# EAGLE design stb_v10 (EAGLE 6.1)
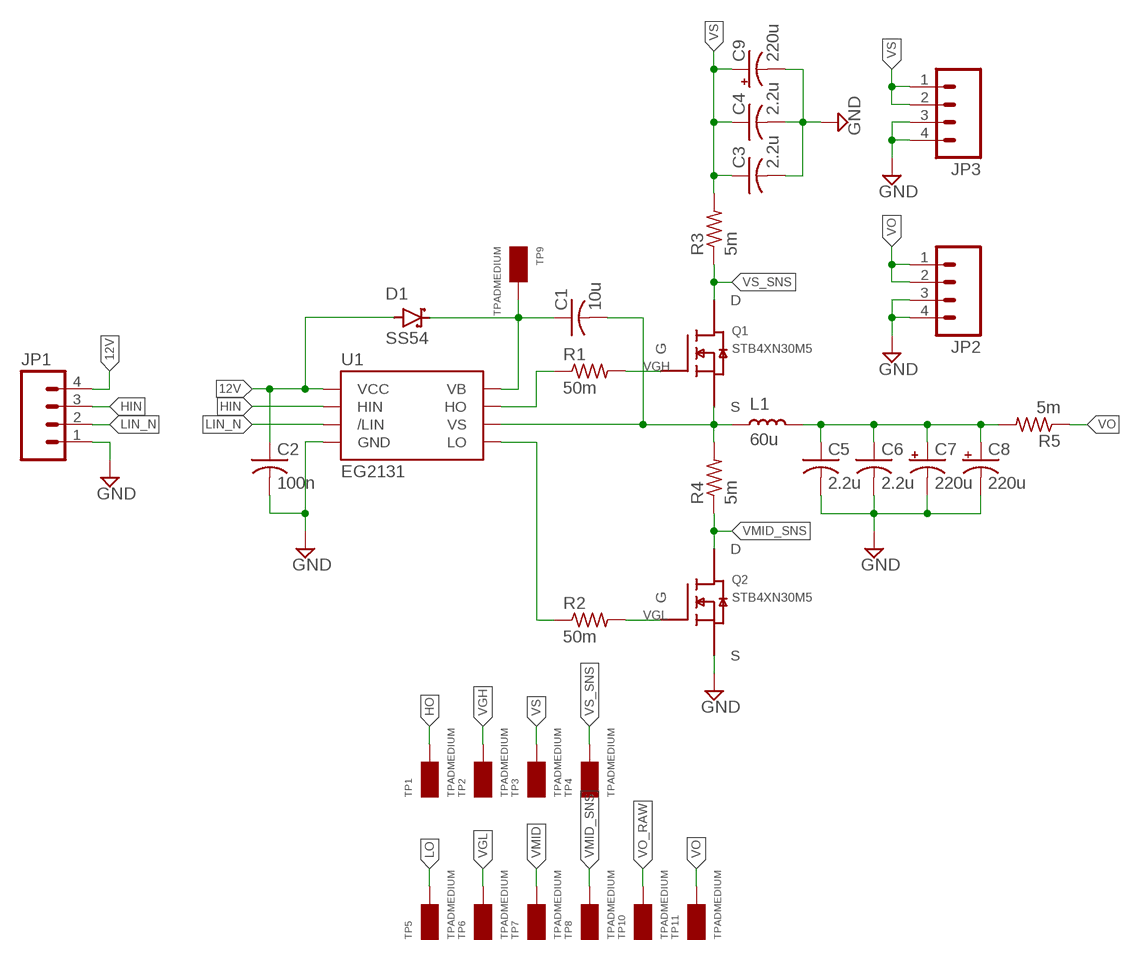
[diagram p0: schematic, sheet 1]

## Parts
C1  10u  C-USC0603  [C0603]
C2  100n  C-USC0603  [C0603]
C3  2.2u  C-USC1210  [C1210]
C4  2.2u  C-USC1210  [C1210]
C5  2.2u  C-USC1210  [C1210]
C6  2.2u  C-USC1210  [C1210]
C7  220u  CPOL-USE5-13  [E5-13]
C8  220u  CPOL-USE5-13  [E5-13]
C9  220u  CPOL-USE5-13  [E5-13]
D1  SS54  [SMA]
JP1  M04PTH  [1X04]
JP2  M04PTH  [1X04]
JP3  M04PTH  [1X04]
L1  60u  INDUCTOR10A  [INDUCTOR_10A_8.2MMX21MM]
Q1  STB4XN30M5  [D2PAK-ST]
Q2  STB4XN30M5  [D2PAK-ST]
R1  50m  R-US_R0603  [R0603]
R2  50m  R-US_R0603  [R0603]
R3  5m  R-US_R2512  [R2512]
R4  5m  R-US_R2512  [R2512]
R5  5m  R-US_R2512  [R2512]
TP1  TPADMEDIUM  [TPAD_MED]
TP2  TPADMEDIUM  [TPAD_MED]
TP3  TPADMEDIUM  [TPAD_MED]
TP4  TPADMEDIUM  [TPAD_MED]
TP5  TPADMEDIUM  [TPAD_MED]
TP6  TPADMEDIUM  [TPAD_MED]
TP7  TPADMEDIUM  [TPAD_MED]
TP8  TPADMEDIUM  [TPAD_MED]
TP9  TPADMEDIUM  [TPAD_MED]
TP10  TPADMEDIUM  [TPAD_MED]
TP11  TPADMEDIUM  [TPAD_MED]
U1  EG2131  [8-SOIC]

## Nets
12V: C2.1 D1.A(ANODE) JP1.4 U1.1(VCC)
GND: C2.2 C3.2 C4.2 C5.2 C6.2 C7.- C8.- C9.- JP1.1 JP2.3 JP2.4 JP3.3 JP3.4 Q2.3-S(S) U1.4(GND)
HIN: JP1.3 U1.2(HIN)
HO: R1.1 TP1.1 U1.7(HO)
LIN_N: JP1.2 U1.3(/LIN)
LO: R2.1 TP5.1 U1.5(LO)
VBST: C1.1 D1.K(CATHODE) TP9.1 U1.8(VB)
VGH: Q1.1-G(G) R1.2 TP2.1
VGL: Q2.1-G(G) R2.2 TP6.1
VMID: C1.2 L1.P$1 Q1.3-S(S) R4.2 TP7.1 U1.6(VS)
VMID_SNS: Q2.2-D(D) R4.1 TP8.1
VO: JP2.1 JP2.2 R5.1 TP11.1
VO_RAW: C5.1 C6.1 C7.+ C8.+ L1.P$2 R5.2 TP10.1
VS: C3.1 C4.1 C9.+ JP3.1 JP3.2 R3.2 TP3.1
VS_SNS: Q1.2-D(D) R3.1 TP4.1

## Library data of the parts
C1-C6 = resistor:C-US: CAPACITOR, American symbol
C7-C9 = resistor:CPOL-US: POLARIZED CAPACITOR, American symbol
D1 = custom:SS54: Diode Schottky 40V 5A 1mA Ir 0.55Vf
JP1-JP3 = SparkFun:M04: Header 4 Standard 4-pin 0.1" header. Use with straight break away headers (SKU : PRT-00116), right angle break away headers (PRT-00553), swiss pins (PRT-00743), machine pins (PRT-00117), and female headers (PRT-00115). Molex polarized connector foot print use with SKU : PRT-08231 with associated crimp pins and housings. 1MM SMD Version SKU: PRT-10208
L1 = custom:INDUCTOR
Q1 Q2 = custom:STB4XN30M5: N-channel MOSFET 300V 53A 0.037Ω D2PAK 10Vgs
R1-R5 = resistor:R-US_: RESISTOR, American symbol
TP1-TP11 = custom:TPAD
U1 = custom:EG2131: IC MOSFET IGBT Driver Synchronous Dual N-Channel Bootstrap 1/1.5A 300V

## Board
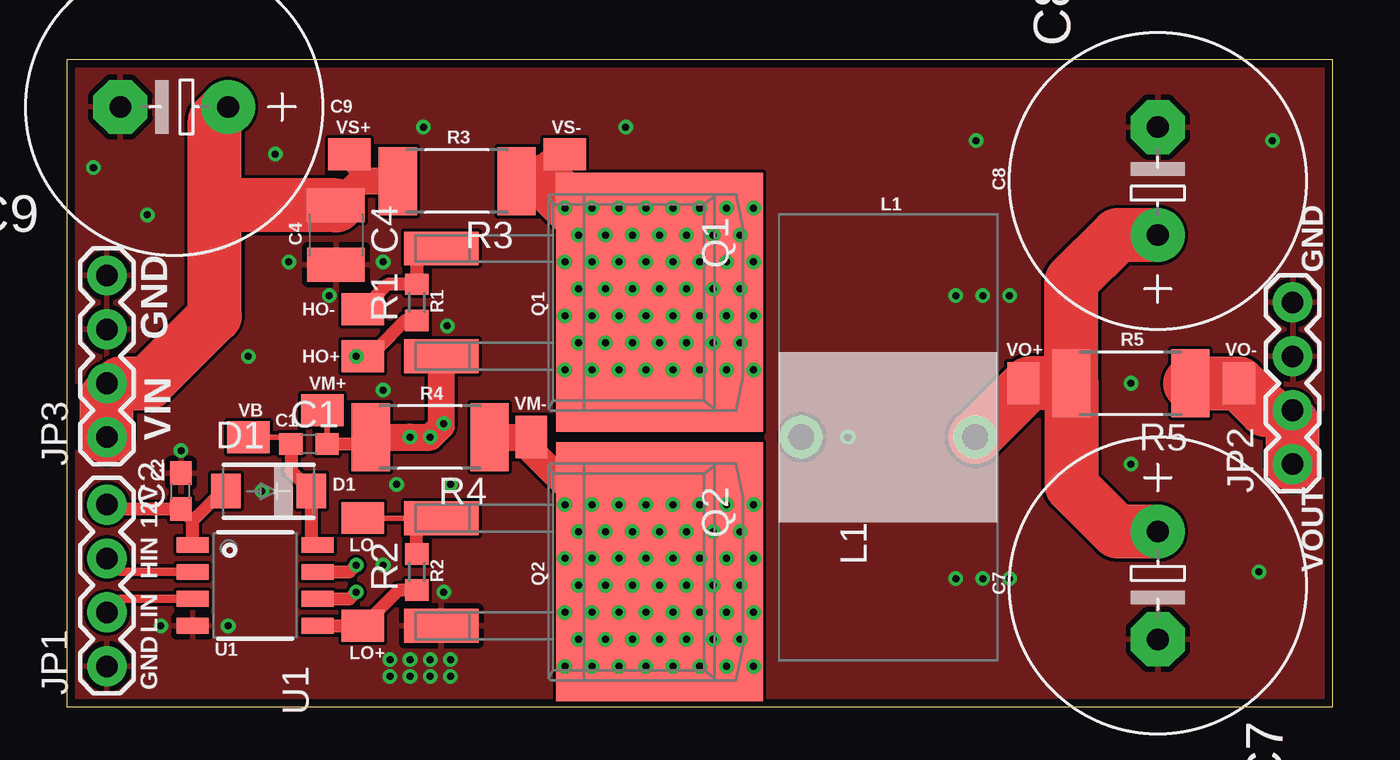
[diagram p1: board, top side]
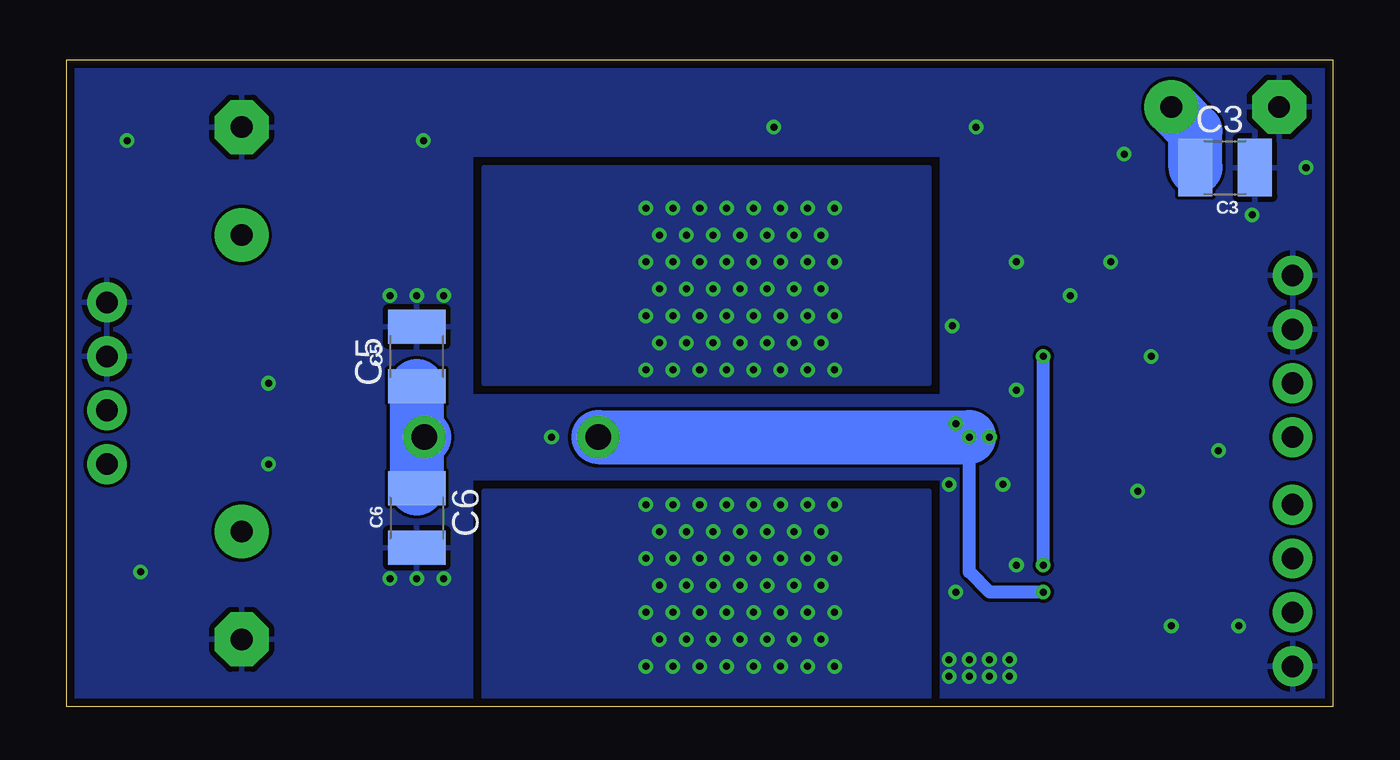
[diagram p2: board, bottom side, seen from below]

Size 59.69 x 30.48 mm. Coordinates in mm from the lower left corner, seen from the top.
Outline: 0,0 59.69,0 59.69,30.48 0,30.48 0,0
Copper layers (1*16): Top 0.0356mm / dielectric 1.5011mm / Bottom 0.0356mm
Design rules: minimum track width 6mil, minimum drill 13mil, track to track 6mil, track to pad 6mil, pad to pad 6mil, via to via 6mil, smd to smd 6mil, copper to edge 15mil, drill to drill 6mil, minimum pad ring 7mil, minimum via ring 7mil, stop-mask expansion 4mil, vias tented up to drill 20mil, thermal gap 10mil

### Footprints (pad centres in the part's own frame; a part is rotated, then mirrored left to right if it is on the bottom)
C0603 = smd 1.1 x 1: 1 -0.85,0; 2 0.85,0
C1210 = smd 1.6 x 2.7: 1 -1.4,0; 2 1.4,0
E5-13 = drill 1.016 pad 2.54: + -2.54,0 | drill 1.016 pad 2.54 octagon: - 2.54,0
SMA = smd 1.4 x 1.64: A -2.015,0; K 2.015,0
1X04 = drill 1.016 pad 1.88: 1 0,0; 2 2.54,0; 3 5.08,0; 4 7.62,0
INDUCTOR_10A_8.2MMX21MM = drill 1.2 pad 2: P$1 0,4.1; P$2 0,-4.1
D2PAK-ST = smd 1.6 x 3.5: 1-G -2.54,-10.275; 3-S 2.54,-10.275 | smd 12.2 x 9.75: 2-D 0,0
R0603 = smd 1 x 1.1: 1 -0.85,0; 2 0.85,0
R2512 = smd 1.8 x 3.2: 1 -2.8,0; 2 2.8,0
TPAD_MED = smd 1.5 x 2: 1 0,0
8-SOIC = smd 0.75 x 1.5: 1 -1.905,-2.95; 2 -0.635,-2.95; 3 0.635,-2.95; 4 1.905,-2.95; 5 1.905,2.95; 6 0.635,2.95; 7 -0.635,2.95; 8 -1.905,2.95

### Placement (x,y rotation side)
C1  11.43,12.38 0 top
C2  5.4,10.16 90 top
C3  5.08,25.4 0 bottom
C4  12.7,22.23 270 top
C5  43.18,16.51 90 bottom
C6  43.18,8.89 270 bottom
C7  51.44,5.71 270 top
C8  51.44,24.77 90 top
C9  5.08,28.26 180 top
D1  9.53,10.16 0 top
JP1  1.91,1.91 90 top
JP2  57.78,11.43 90 top
JP3  1.91,12.7 90 top
L1  38.73,12.7 90 top
Q1  27.94,19.05 270 top
Q2  27.94,6.35 270 top
R1  16.51,19.05 90 top
R2  16.51,6.35 90 top
R3  18.41,24.77 180 top
R4  17.14,12.7 180 top
R5  50.16,15.24 180 top
TP1  13.97,16.51 90 top
TP2  13.97,18.73 90 top
TP3  13.34,26.04 90 top
TP4  23.5,26.04 90 top
TP5  13.97,3.81 90 top
TP6  13.97,8.89 90 top
TP7  12.06,13.97 270 top
TP8  21.91,12.7 0 top
TP9  8.57,12.7 270 top
TP10  45.09,15.24 0 top
TP11  55.24,15.24 0 top
U1  8.89,5.71 270 top

### Tracks (layer width: path | path; a pad name or v marks a point on that pad's centre or on a via)
12V
  Top 0.61: U1.1 5.94,8.77 | 5.94,8.77 C2.1 2.12,9.31 JP1.4 | D1.A 7.33,10.16 5.94,8.77
GND  (via drill 0.33)
  other vias: 7.62,3.81 4.45,3.81 5.4,12.06 14.92,6.67 9.21,10.16 14.92,14.92 14.92,20.95 12.38,19.37 10.48,20.95 3.81,23.18 41.91,19.37 43.18,19.37 44.45,19.37 41.91,6.03 43.18,6.03 44.45,6.03 50.16,15.24 36.83,12.7 50.16,11.43 15.56,10.48 18.1,10.48 17.78,5.4 16.19,2.22 17.14,2.22 18.1,2.22 18.1,1.43 17.14,1.43 16.19,1.43 15.24,2.22 8.57,16.51 9.84,26.04 16.83,27.3 26.35,27.3 42.86,26.67 56.2,6.35 56.83,26.67 15.24,1.43 17.94,17.94 1.27,25.4
  pour Top: 0,30.48 59.69,30.48 59.69,0 0,0
  pour Bottom: 0,30.48 18.41,30.48 18.41,0 0,0
  pour Bottom: 18.41,30.48 59.69,30.48 59.69,26.04 18.41,26.04
  pour Bottom: 18.41,14.61 59.69,14.61 59.69,10.79 18.41,10.79
  pour Bottom: 40.64,26.04 59.69,26.04 59.69,14.61 40.64,14.61
  pour Bottom: 40.64,10.79 59.69,10.79 59.69,0 40.64,0
HIN
  Top 0.406: U1.2 2.54,6.35 JP1.3
HO  (via drill 0.33)
  Top 0.61: U1.7 13.34,6.35 v13.65,6.67 | v13.65,16.51 TP1.1 14.29,16.83 14.61,16.83 15.98,18.2 R1.1
  Bottom 0.61: v13.65,6.67 v13.65,16.51
LIN_N
  Top 0.406: U1.3 2.54,5.08 JP1.2
LO
  Top 0.61: U1.5 TP5.1 15.66,5.5 R2.1
VBST
  Top 0.254: TP9.1 10.26,12.7 C1.1
  Top 0.61: U1.8 11.54,7.92 D1.K 10.58,11.12 C1.1
VGH
  Top 0.61: TP2.1 15.14,19.9 R1.2 16.51,20.95 17.14,21.59 Q1.1-G
VGL
  Top 0.254: TP6.1 17.14,8.89 Q2.1-G
  Top 0.61: R2.2 16.51,8.26 17.14,8.89
VMID  (via drill 0.33)
  Top 0.254: C1.2 12.28,13.76 TP7.1 | v17.78,13.34 17.66,13.34
  Top 0.61: C1.2 14.03,12.38 R4.2 | U1.6 13.34,5.08 v13.65,5.4
  Top 1.27: Q1.3-S 17.66,13.34 17.66,13.22 v17.14,12.7 v16.19,12.7 R4.2
  Bottom 0.61: v13.65,5.4 16.19,5.4 17.14,6.35 v17.14,12.7
  Bottom 2.54: L1.P$1 v17.14,12.7
VMID_SNS  (via drill 0.33)
  Top 0.254: 21.91,12.06 21.91,11.75 23.5,10.16 v23.5,9.53
  Top 1.27: R4.1 TP8.1 21.91,12.06 27.62,6.35 Q2.2-D
  other vias: 24.77,9.53 26.04,9.53 27.3,9.53 28.57,9.53 29.84,9.53 31.11,9.53 32.38,9.53 31.75,8.26 30.48,8.26 29.21,8.26 27.94,8.26 26.67,8.26 25.4,8.26 24.13,8.26 23.5,6.99 24.77,6.99 26.04,6.99 27.3,6.99 28.57,6.99 29.84,6.99 31.11,6.99 32.38,6.99 31.75,5.71 30.48,5.71 29.21,5.71 27.94,5.71 26.67,5.71 25.4,5.71 24.13,5.71 23.5,4.45 24.77,4.45 26.04,4.45 27.3,4.45 28.57,4.45 29.84,4.45 31.11,4.45 32.38,4.45 31.75,3.17 30.48,3.17 29.21,3.17 27.94,3.17 26.67,3.17 25.4,3.17 24.13,3.17 23.5,1.91 24.77,1.91 26.04,1.91 27.3,1.91 28.57,1.91 29.84,1.91 31.11,1.91 32.38,1.91
  pour Bottom: 19.05,10.16 40.01,10.16 40.01,0 19.05,0
VO
  Top 0.254: JP2.2 57.78,13.34
  Top 1.27: 56.52,13.97 JP2.2
  Top 2.54: JP2.1 57.78,13.34 | R5.1 TP11.1 56.52,13.97
VO_RAW
  Top 0.254: 45.38,15.24 TP10.1
  Top 2.54: R5.2 45.38,15.24 L1.P$2 | C8.+ 49.53,22.23 47.37,20.06 R5.2 | C7.+ 49.53,8.26 47.37,10.42 R5.2
  Bottom 2.54: C5.1 43.18,12.7 | 43.18,12.7 C6.1 | L1.P$2 43.18,12.7
VS
  Top 0.254: TP3.1 13.34,25.27 13.84,24.77
  Top 1.27: 1.91,14.61 JP3.2 2.54,15.24 | R3.2 13.84,24.77 C4.1
  Top 2.54: JP3.1 1.91,14.61 | 2.54,15.24 3.81,15.24 6.99,18.41 6.99,23.5 | 6.99,23.5 6.99,27.62 C9.+ | C4.1 7.12,23.62 6.99,23.5
  Bottom 2.54: C3.1 6.48,27.12 C9.+
VS_SNS  (via drill 0.33)
  Top 0.254: TP4.1 22.48,26.04 R3.1 | Q1.2-D v27.94,19.68
  Top 1.27: 22.54,24.77 R3.1
  Top 2.54: Q1.2-D 27.94,19.37 22.54,24.77
  other vias: 23.5,15.88 24.77,15.88 26.04,15.88 27.3,15.88 28.57,15.88 29.84,15.88 31.11,15.88 32.38,15.88 24.13,17.14 25.4,17.14 26.67,17.14 27.94,17.14 29.21,17.14 30.48,17.14 31.75,17.14 23.5,18.41 24.77,18.41 26.04,18.41 27.3,18.41 28.57,18.41 29.84,18.41 31.11,18.41 32.38,18.41 31.75,19.68 30.48,19.68 29.21,19.68 26.67,19.68 25.4,19.68 24.13,19.68 23.5,20.95 24.77,20.95 26.04,20.95 27.3,20.95 28.57,20.95 29.84,20.95 31.11,20.95 32.38,20.95 31.75,22.23 30.48,22.23 29.21,22.23 27.94,22.23 26.67,22.23 25.4,22.23 24.13,22.23 23.5,23.5 24.77,23.5 26.04,23.5 27.3,23.5 28.57,23.5 29.84,23.5 31.11,23.5 32.38,23.5
  pour Bottom: 19.05,25.4 40.01,25.4 40.01,15.24 19.05,15.24

### Text on the board
tPlace: C9 | VS+ | R3 | VS- | C8 | L1 | C4 | GND | R1 | HO- | Q1 | GND | VO+ | R5 | VO- | HO+ | VM+ | VB | R4 | VM- | VIN | C1 | C2 | D1 | 12V | LO- | HIN | R2 | Q2 | C7 | VOUT | LIN | U1 | LO+ | GND
bPlace: C3 | C5 | C6
tStop: v1.0 | EG2131 + STB45N30M5 | synch. module
bStop: justin kenny 2019